# Altium schematic sheet Sheet1.SchDoc
size A4
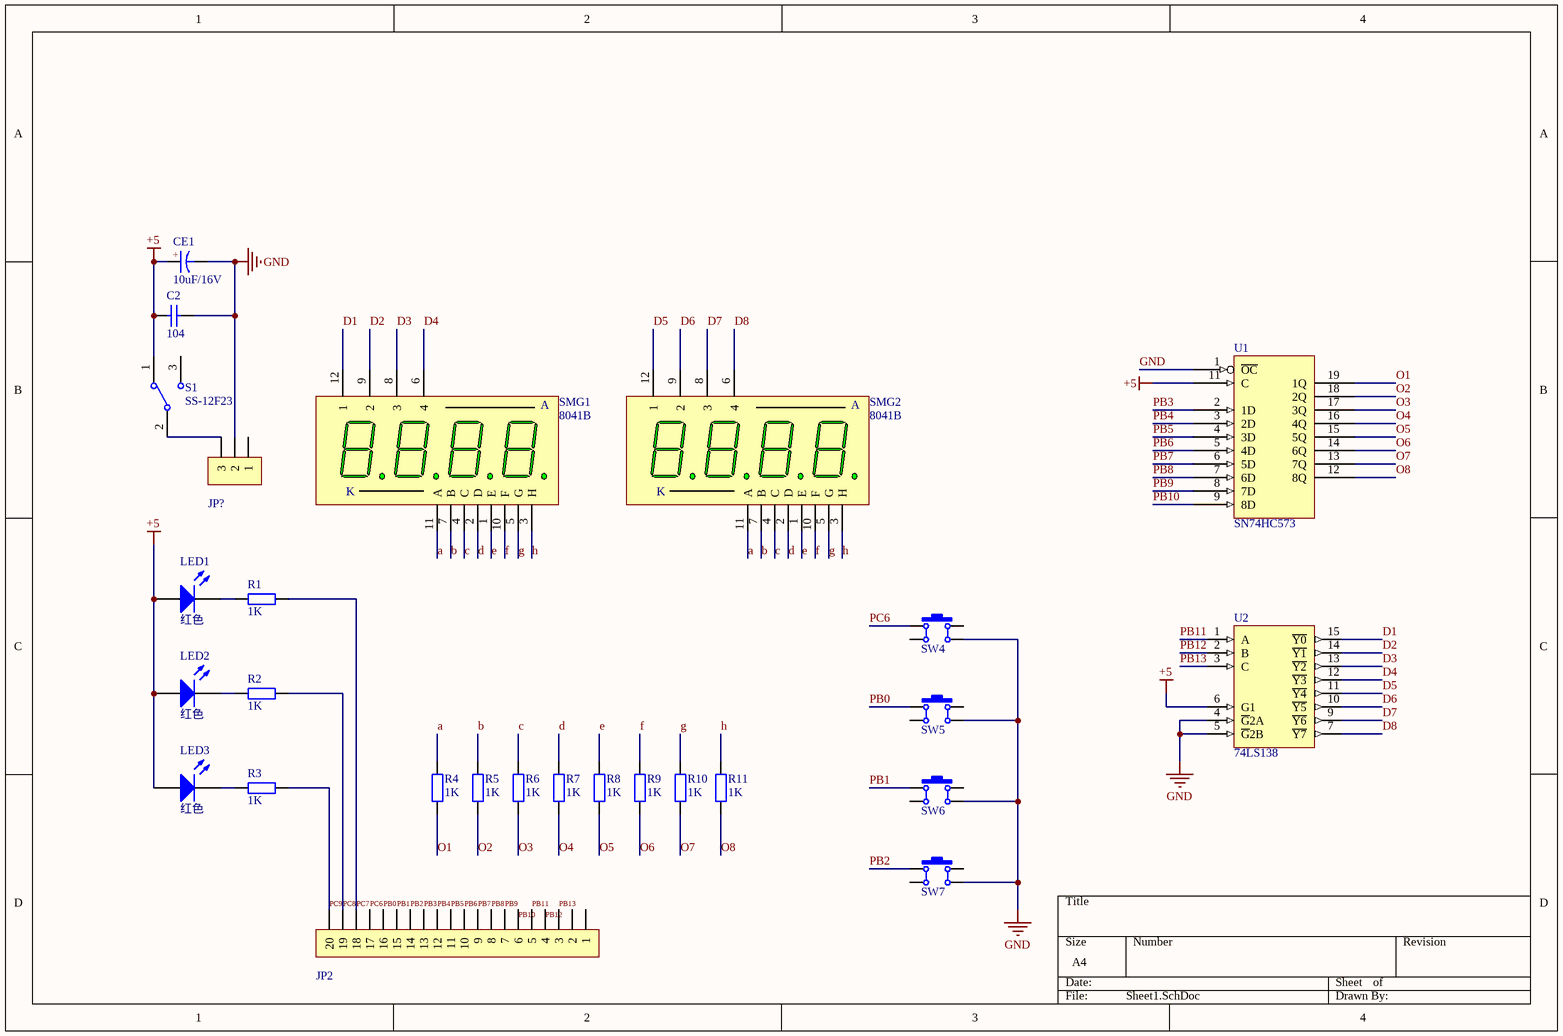
[diagram p0: Sheet1.SchDoc]

## Parts
C2  104  [CC 1.8*3.6]
CE1  10uF/16V  [CAP 1.5*4*8]
JP2  HDR-1X20  [PH2.0-WS-20P]  (value not drawn)
JP?  HDR-1X3  [XH2.54-WI-3P]  (value not drawn)
LED1  红色  [LED 3MM-B]
LED2  红色  [LED 3MM-B]
LED3  红色  [LED 3MM-B]
R1  1K  [RS 1/4W]
R2  1K  [RS 1/4W]
R3  1K  [RS 1/4W]
R4  1K  [RS 1/4W]
R5  1K  [RS 1/4W]
R6  1K  [RS 1/4W]
R7  1K  [RS 1/4W]
R8  1K  [RS 1/4W]
R9  1K  [RS 1/4W]
R10  1K  [RS 1/4W]
R11  1K  [RS 1/4W]
S1  SS-12F23  [MSK-12C01-07]
SMG1  8041B  [SMG 0.8-4P]
SMG2  8041B  [SMG 0.8-4P]
SW4  4x4x1.5  [SW SMD-4*4*1.5]  (value not drawn)
SW5  4x4x1.5  [SW SMD-4*4*1.5]  (value not drawn)
SW6  4x4x1.5  [SW SMD-4*4*1.5]  (value not drawn)
SW7  4x4x1.5  [SW SMD-4*4*1.5]  (value not drawn)
U1  SN74HC573  [DIP-20]
U2  74LS138  [DIP-16]

## Nets
+5: C2.1 CE1.1 LED1.1(A) LED2.1(A) LED3.1(A) S1.1 U1.11(C) U2.6(G1)
GND: C2.2 CE1.2 JP?.2 SW4.3 SW5.3 SW6.3 SW7.3 U1.1(~{OC}) U1.10(GND) U2.4(~{G}2A) U2.5(~{G}2B) U2.8(GND)
VCC: U1.20(VCC) U2.16(VCC)
a: R4.2 SMG1.11(A) SMG2.11(A)
b: R5.2 SMG1.7(B) SMG2.7(B)
c: R6.2 SMG1.4(C) SMG2.4(C)
d: R7.2 SMG1.2(D) SMG2.2(D)
D1: SMG1.12(1) U2.15(~{Y0})
D2: SMG1.9(2) U2.14(~{Y1})
D3: SMG1.8(3) U2.13(~{Y2})
D4: SMG1.6(4) U2.12(~{Y3})
D5: SMG2.12(1) U2.11(~{Y4})
D6: SMG2.9(2) U2.10(~{Y5})
D7: SMG2.8(3) U2.9(~{Y6})
D8: SMG2.6(4) U2.7(~{Y7})
e: R8.2 SMG1.1(E) SMG2.1(E)
f: R9.2 SMG1.10(F) SMG2.10(F)
g: R10.2 SMG1.5(G) SMG2.5(G)
h: R11.2 SMG1.3(H) SMG2.3(H)
O1: R4.1 U1.19(1Q)
O2: R5.1 U1.18(2Q)
O3: R6.1 U1.17(3Q)
O4: R7.1 U1.16(4Q)
O5: R8.1 U1.15(5Q)
O6: R9.1 U1.14(6Q)
O7: R10.1 U1.13(7Q)
O8: R11.1 U1.12(8Q)
PB0: JP2.16 SW5.1
PB1: JP2.15 SW6.1
PB2: JP2.14 SW7.1
PB3: JP2.13 U1.2(1D)
PB4: JP2.12 U1.3(2D)
PB5: JP2.11 U1.4(3D)
PB6: JP2.10 U1.5(4D)
PB7: JP2.9 U1.6(5D)
PB8: JP2.8 U1.7(6D)
PB9: JP2.7 U1.8(7D)
PB10: JP2.6 U1.9(8D)
PB11: JP2.5 U2.1(A)
PB12: JP2.4 U2.2(B)
PB13: JP2.3 U2.3(C)
PC6: JP2.17 SW4.1
PC7: JP2.18 R1.2
PC8: JP2.19 R2.2
PC9: JP2.20 R3.2
NetJP?_3: JP?.3 S1.2
NetLED1_2: LED1.2(K) R1.1
NetLED2_2: LED2.2(K) R2.1
NetLED3_2: LED3.2(K) R3.1

Not connected (* = marked no-connect by the designer): JP2 1 2; JP? 1; S1 3; SW4 2 4; SW5 2 4; SW6 2 4; SW7 2 4

## Notes on the sheet
- (in symbol 8041B) K
- (in symbol CE) +

## Library data of the parts
C2 = CC: 瓷片电容; BOM名称: 直插瓷片电容; 联系卖家，免费查找封装: 唯一出售店铺网址https://shop463601444.taobao.com; 封装库来自淘宝卖家ID：黄晶宝石: 其他店铺购入均为盗版假冒封装库
CE1 = CE: 直插电解电容; 联系卖家，免费查找封装: 唯一出售店铺网址https://shop463601444.taobao.com; 封装库来自淘宝卖家ID：黄晶宝石: 其他店铺购入均为盗版假冒封装库; BOM名称: 直插电解电容
JP2 = Header 20: 20P接插件; 封装库来自淘宝卖家 ID：黄晶宝石: https://shop463601444.taobao.com
JP? = Header 3: 3P接插件; 封装库来自淘宝卖家 ID：黄晶宝石: 其他店铺购入均为盗版假冒封装库; 联系卖家，免费查找封装: 唯一出售店铺网址https://shop463601444.taobao.com; BOM名称: 3P接插件
LED1-LED3 = LED-3MM: 直插3mm LED; BOM名称: 插件LED; 封装库来自淘宝卖家 ID：黄晶宝石: 其他店铺购入均为假冒，请立即申请退款，本店奖励2~5元现金
R1-R11 = R-S: 色环电阻; 联系卖家，免费查找封装: 唯一出售店铺网址https://shop463601444.taobao.com; 封装库来自淘宝卖家ID：黄晶宝石: 其他店铺购入均为盗版假冒封装库; BOM名称: 色环电阻
S1 = SSW-1P: 1路波动开关; BOM名称: 波动开关; 联系卖家，免费查找封装: 唯一出售店铺网址https://shop463601444.taobao.com
SMG1 SMG2 = 8041B: 0.8寸4位共阳数码管; 封装库来自淘宝卖家ID：黄晶宝石: 其他店铺购入均为盗版假冒封装库; BOM名称: 0.8寸4位共阳
SW4-SW7 = TSW SMD-4x4: 贴片4x4轻触开关; 联系卖家，免费查找封装: 唯一出售店铺网址https://shop463601444.taobao.com; BOM名称: 贴片4x4轻触开关
U1 = SN74HC573: OCTAL D-TYPE TRANSPARENT LCH 3SO; 技术支持，联系售后: 唯一出售店铺网址https://shop463601444.taobao.com
U2 = 74LS138: 3-Line to 8-Line Decoder/Demultiplexer; 技术支持，联系售后: 唯一出售店铺网址https://shop463601444.taobao.com